# Altium schematic sheet design_7.SchDoc: design
size 414 x 279 mm; Date: 1/25/2021 11:39:22 PM; SheetNumber: 8; Origin: Eagle; GateName_1: G$1; SymbolName_1: A3-L-GUMSTIX; LibraryName: qualified_1; DeviceSetName: A3-L-GUMSTIX; A: A; B: B; C: C; D: D; E: E; F: F; G: G; H: H; 1: 1; 2: 2; 3: 3; 4: 4; 5: 5; Sheet: Sheet:; C:/Gumstix/gumstix-logo-16.bmp: C:/Gumstix/gumstix-logo-16.bmp; Board: Board:
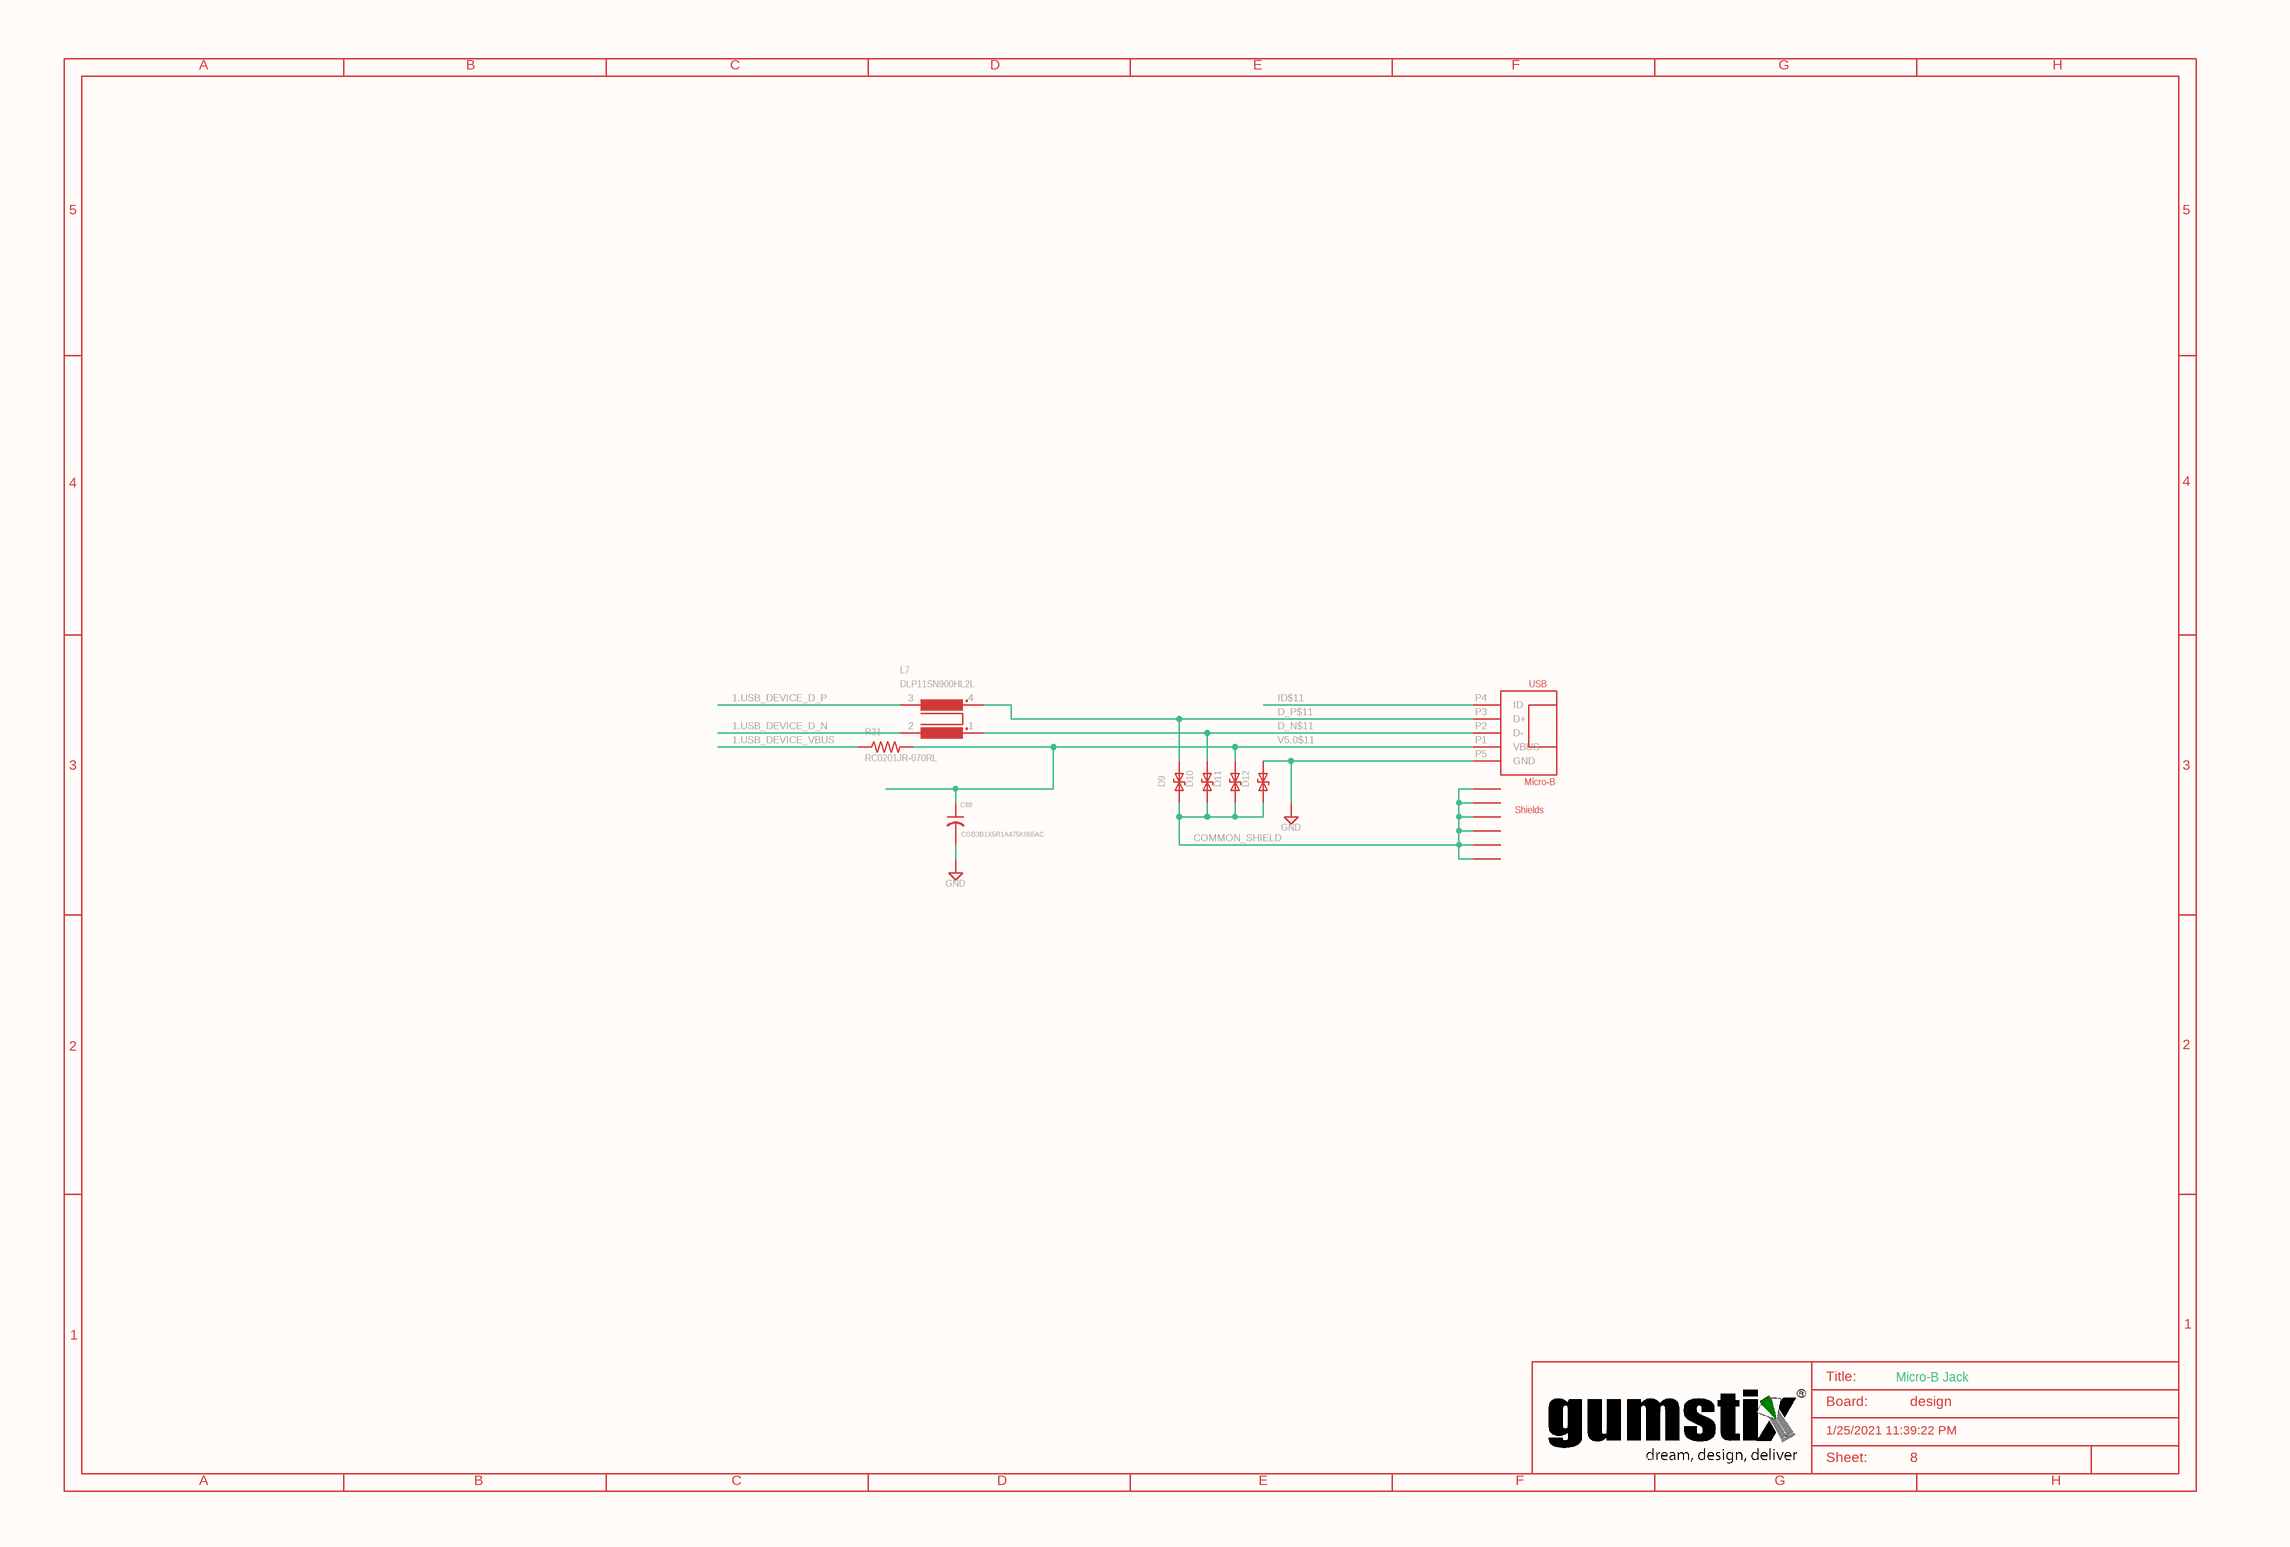
[diagram p0: design_7.SchDoc]

## Parts
C89  CGB3B1X5R1A475K055AC  [0603]
D9  PS04LTVA1  [D0402]  (value not drawn)
D10  PS04LTVA1  [D0402]  (value not drawn)
D11  B72590D0050A060  [D0402]  (value not drawn)
D12  B72590D0050A060  [D0402]  (value not drawn)
J3  10118192-0001LF  [USB_MICRO_B]  (value not drawn)
L7  DLP11SN900HL2L  [0504-DLP11S]
R31  RC0201JR-070RL  [0201]
SUPPLY69  GND
SUPPLY135  GND

## Nets
1.USB_DEVICE_D_N: L7.2
1.USB_DEVICE_D_P: L7.3
1.USB_DEVICE_VBUS: R31.1
COMMON_SHIELD: D9.P1 D10.P1 D11.P1 D12.P1 J3.COMMON_SHEILD1(COMMON_SHIELD1) J3.COMMON_SHEILD2(COMMON_SHIELD2) J3.COMMON_SHEILD3(COMMON_SHIELD3) J3.COMMON_SHEILD4(COMMON_SHIELD4) J3.COMMON_SHEILD5(COMMON_SHIELD5) J3.COMMON_SHEILD6(COMMON_SHIELD6)
D_N$11: D10.P2 J3.P2(D-) L7.1
D_P$11: D9.P2 J3.P3(D+) L7.4
ID$11: J3.P4(ID)
V5.0$11: C89.1 D11.P2 J3.P1(VBUS) R31.2
NetC89_2: C89.2 SUPPLY135.?1(GND)
NetD12_P2: D12.P2 J3.P5(GND) SUPPLY69.?1(GND)

## Notes on the sheet
- A
- B
- C
- D
- E
- F
- G
- H
- 5
- 4
- 3
- 2
- 1
- Title:
- Board:
- Micro-B Jack
- design
- C:/Gumstix/gumstix-logo-16.bmp
- 1/25/2021 11:39:22 PM
- Sheet:
- 8

## Library data of the parts
C89 = CGB3B1X5R1A475K055AC: GateName_1: G$1; SymbolName_1: C-US; LibraryName: qualified_1; DeviceSetName: CGB3B1X5R1A475K055AC; HEIGHT: 0.5
D9 D10 = PS04LTVA1: GateName_1: G$1; SymbolName_1: ESD-DIODE; LibraryName: qualified_1; DeviceSetName: PS04LTVA1; HEIGHT: 0.35
D11 D12 = B72590D0050A060: GateName_1: G$1; SymbolName_1: ESD-DIODE; LibraryName: qualified_1; DeviceSetName: B72590D0050A060; HEIGHT: 0.35
J3 = 10118192-0001LF: GateName_1: G$1; SymbolName_1: USB_MICRO_B; LibraryName: qualified_1; DeviceSetName: 10118192-0001LF; Shields: Shields; Micro-B: Micro-B; USB: USB
L7 = DLP11SN900HL2L: GateName_1: G$1; SymbolName_1: COM_MODE_CHOKE_DLP; LibraryName: qualified_1; DeviceSetName: DLP11SN900HL2L; HEIGHT: 0.83
R31 = RC0201JR-070RL: GateName_1: G$1; SymbolName_1: R-US; LibraryName: qualified_1; DeviceSetName: RC0201JR-070RL; HEIGHT: 0.25
SUPPLY69 = GND: SUPPLY SYMBOL; GateName_1: GND; SymbolName_1: GND; LibraryName: supply2; DeviceSetName: GND
SUPPLY135 = GND: SUPPLY SYMBOL; SymbolName_1: GND-2; GateName_1: GND; LibraryName: qualified_1; DeviceSetName: GND